# Altium schematic sheet Copy of tsop_mux.SchDoc
size A4
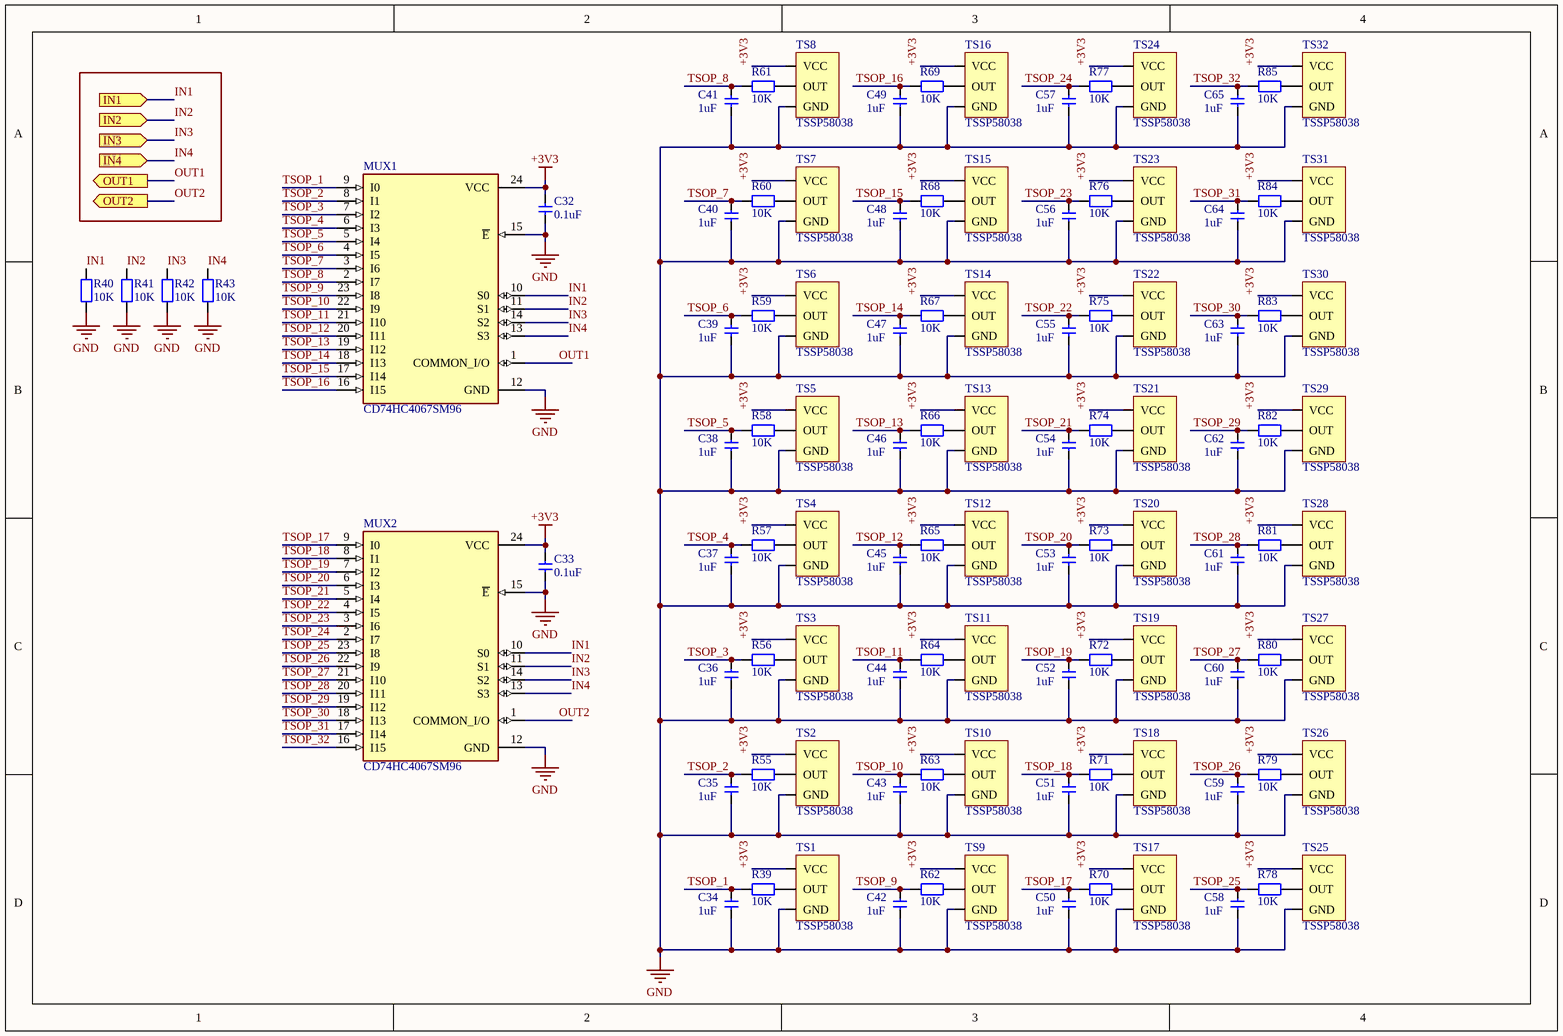
[diagram p0: Copy of tsop_mux.SchDoc]

## Parts
C32  0.1uF  [CAP0805]
C33  0.1uF  [CAP0805]
C34  1uF  [CAP1206]
C35  1uF  [CAP1206]
C36  1uF  [CAP1206]
C37  1uF  [CAP1206]
C38  1uF  [CAP1206]
C39  1uF  [CAP1206]
C40  1uF  [CAP1206]
C41  1uF  [CAP1206]
C42  1uF  [CAP1206]
C43  1uF  [CAP1206]
C44  1uF  [CAP1206]
C45  1uF  [CAP1206]
C46  1uF  [CAP1206]
C47  1uF  [CAP1206]
C48  1uF  [CAP1206]
C49  1uF  [CAP1206]
C50  1uF  [CAP1206]
C51  1uF  [CAP1206]
C52  1uF  [CAP1206]
C53  1uF  [CAP1206]
C54  1uF  [CAP1206]
C55  1uF  [CAP1206]
C56  1uF  [CAP1206]
C57  1uF  [CAP1206]
C58  1uF  [CAP1206]
C59  1uF  [CAP1206]
C60  1uF  [CAP1206]
C61  1uF  [CAP1206]
C62  1uF  [CAP1206]
C63  1uF  [CAP1206]
C64  1uF  [CAP1206]
C65  1uF  [CAP1206]
MUX1  CD74HC4067SM96  [CD74HC4067SM96]
MUX2  CD74HC4067SM96  [CD74HC4067SM96]
R39  10K  [RES0603]
R40  10K  [RES0805]
R41  10K  [RES0805]
R42  10K  [RES0805]
R43  10K  [RES0805]
R55  10K  [RES0603]
R56  10K  [RES0603]
R57  10K  [RES0603]
R58  10K  [RES0603]
R59  10K  [RES0603]
R60  10K  [RES0603]
R61  10K  [RES0603]
R62  10K  [RES0603]
R63  10K  [RES0603]
R64  10K  [RES0603]
R65  10K  [RES0603]
R66  10K  [RES0603]
R67  10K  [RES0603]
R68  10K  [RES0603]
R69  10K  [RES0603]
R70  10K  [RES0603]
R71  10K  [RES0603]
R72  10K  [RES0603]
R73  10K  [RES0603]
R74  10K  [RES0603]
R75  10K  [RES0603]
R76  10K  [RES0603]
R77  10K  [RES0603]
R78  10K  [RES0603]
R79  10K  [RES0603]
R80  10K  [RES0603]
R81  10K  [RES0603]
R82  10K  [RES0603]
R83  10K  [RES0603]
R84  10K  [RES0603]
R85  10K  [RES0603]
TS1  TSSP58038  [TSSP58038]
TS2  TSSP58038  [TSSP58038]
TS3  TSSP58038  [TSSP58038]
TS4  TSSP58038  [TSSP58038]
TS5  TSSP58038  [TSSP58038]
TS6  TSSP58038  [TSSP58038]
TS7  TSSP58038  [TSSP58038]
TS8  TSSP58038  [TSSP58038]
TS9  TSSP58038  [TSSP58038]
TS10  TSSP58038  [TSSP58038]
TS11  TSSP58038  [TSSP58038]
TS12  TSSP58038  [TSSP58038]
TS13  TSSP58038  [TSSP58038]
TS14  TSSP58038  [TSSP58038]
TS15  TSSP58038  [TSSP58038]
TS16  TSSP58038  [TSSP58038]
TS17  TSSP58038  [TSSP58038]
TS18  TSSP58038  [TSSP58038]
TS19  TSSP58038  [TSSP58038]
TS20  TSSP58038  [TSSP58038]
TS21  TSSP58038  [TSSP58038]
TS22  TSSP58038  [TSSP58038]
TS23  TSSP58038  [TSSP58038]
TS24  TSSP58038  [TSSP58038]
TS25  TSSP58038  [TSSP58038]
TS26  TSSP58038  [TSSP58038]
TS27  TSSP58038  [TSSP58038]
TS28  TSSP58038  [TSSP58038]
TS29  TSSP58038  [TSSP58038]
TS30  TSSP58038  [TSSP58038]
TS31  TSSP58038  [TSSP58038]
TS32  TSSP58038  [TSSP58038]

## Ports
IN1 (in), IN2 (in), IN3 (in), IN4 (in), OUT1 (out), OUT2 (out)

## Nets
+3V3: C32.2 C33.2 MUX1.24(VCC) MUX2.24(VCC) TS1.1(VCC) TS2.1(VCC) TS3.1(VCC) TS4.1(VCC) TS5.1(VCC) TS6.1(VCC) TS7.1(VCC) TS8.1(VCC) TS9.1(VCC) TS10.1(VCC) TS11.1(VCC) TS12.1(VCC) TS13.1(VCC) TS14.1(VCC) TS15.1(VCC) TS16.1(VCC) TS17.1(VCC) TS18.1(VCC) TS19.1(VCC) TS20.1(VCC) TS21.1(VCC) TS22.1(VCC) TS23.1(VCC) TS24.1(VCC) TS25.1(VCC) TS26.1(VCC) TS27.1(VCC) TS28.1(VCC) TS29.1(VCC) TS30.1(VCC) TS31.1(VCC) TS32.1(VCC)
GND: C32.1 C33.1 C34.2 C35.2 C36.2 C37.2 C38.2 C39.2 C40.2 C41.2 C42.2 C43.2 C44.2 C45.2 C46.2 C47.2 C48.2 C49.2 C50.2 C51.2 C52.2 C53.2 C54.2 C55.2 C56.2 C57.2 C58.2 C59.2 C60.2 C61.2 C62.2 C63.2 C64.2 C65.2 MUX1.12(GND) MUX1.15(~{E}) MUX2.12(GND) MUX2.15(~{E}) R40.1 R41.1 R42.1 R43.1 TS1.2(GND) TS2.2(GND) TS3.2(GND) TS4.2(GND) TS5.2(GND) TS6.2(GND) TS7.2(GND) TS8.2(GND) TS9.2(GND) TS10.2(GND) TS11.2(GND) TS12.2(GND) TS13.2(GND) TS14.2(GND) TS15.2(GND) TS16.2(GND) TS17.2(GND) TS18.2(GND) TS19.2(GND) TS20.2(GND) TS21.2(GND) TS22.2(GND) TS23.2(GND) TS24.2(GND) TS25.2(GND) TS26.2(GND) TS27.2(GND) TS28.2(GND) TS29.2(GND) TS30.2(GND) TS31.2(GND) TS32.2(GND)
IN1: MUX1.10(S0) MUX2.10(S0) R40.2 ; port IN1
IN2: MUX1.11(S1) MUX2.11(S1) R41.2 ; port IN2
IN3: MUX1.14(S2) MUX2.14(S2) R42.2 ; port IN3
IN4: MUX1.13(S3) MUX2.13(S3) R43.2 ; port IN4
OUT1: MUX1.1(COMMON_I/O) ; port OUT1
OUT2: MUX2.1(COMMON_I/O) ; port OUT2
TSOP_1: C34.1 MUX1.9(I0) R39.1
TSOP_2: C35.1 MUX1.8(I1) R55.1
TSOP_3: C36.1 MUX1.7(I2) R56.1
TSOP_4: C37.1 MUX1.6(I3) R57.1
TSOP_5: C38.1 MUX1.5(I4) R58.1
TSOP_6: C39.1 MUX1.4(I5) R59.1
TSOP_7: C40.1 MUX1.3(I6) R60.1
TSOP_8: C41.1 MUX1.2(I7) R61.1
TSOP_9: C42.1 MUX1.23(I8) R62.1
TSOP_10: C43.1 MUX1.22(I9) R63.1
TSOP_11: C44.1 MUX1.21(I10) R64.1
TSOP_12: C45.1 MUX1.20(I11) R65.1
TSOP_13: C46.1 MUX1.19(I12) R66.1
TSOP_14: C47.1 MUX1.18(I13) R67.1
TSOP_15: C48.1 MUX1.17(I14) R68.1
TSOP_16: C49.1 MUX1.16(I15) R69.1
TSOP_17: C50.1 MUX2.9(I0) R70.1
TSOP_18: C51.1 MUX2.8(I1) R71.1
TSOP_19: C52.1 MUX2.7(I2) R72.1
TSOP_20: C53.1 MUX2.6(I3) R73.1
TSOP_21: C54.1 MUX2.5(I4) R74.1
TSOP_22: C55.1 MUX2.4(I5) R75.1
TSOP_23: C56.1 MUX2.3(I6) R76.1
TSOP_24: C57.1 MUX2.2(I7) R77.1
TSOP_25: C58.1 MUX2.23(I8) R78.1
TSOP_26: C59.1 MUX2.22(I9) R79.1
TSOP_27: C60.1 MUX2.21(I10) R80.1
TSOP_28: C61.1 MUX2.20(I11) R81.1
TSOP_29: C62.1 MUX2.19(I12) R82.1
TSOP_30: C63.1 MUX2.18(I13) R83.1
TSOP_31: C64.1 MUX2.17(I14) R84.1
TSOP_32: C65.1 MUX2.16(I15) R85.1
NetR39_2: R39.2 TS1.3(OUT)
NetR55_2: R55.2 TS2.3(OUT)
NetR56_2: R56.2 TS3.3(OUT)
NetR57_2: R57.2 TS4.3(OUT)
NetR58_2: R58.2 TS5.3(OUT)
NetR59_2: R59.2 TS6.3(OUT)
NetR60_2: R60.2 TS7.3(OUT)
NetR61_2: R61.2 TS8.3(OUT)
NetR62_2: R62.2 TS9.3(OUT)
NetR63_2: R63.2 TS10.3(OUT)
NetR64_2: R64.2 TS11.3(OUT)
NetR65_2: R65.2 TS12.3(OUT)
NetR66_2: R66.2 TS13.3(OUT)
NetR67_2: R67.2 TS14.3(OUT)
NetR68_2: R68.2 TS15.3(OUT)
NetR69_2: R69.2 TS16.3(OUT)
NetR70_2: R70.2 TS17.3(OUT)
NetR71_2: R71.2 TS18.3(OUT)
NetR72_2: R72.2 TS19.3(OUT)
NetR73_2: R73.2 TS20.3(OUT)
NetR74_2: R74.2 TS21.3(OUT)
NetR75_2: R75.2 TS22.3(OUT)
NetR76_2: R76.2 TS23.3(OUT)
NetR77_2: R77.2 TS24.3(OUT)
NetR78_2: R78.2 TS25.3(OUT)
NetR79_2: R79.2 TS26.3(OUT)
NetR80_2: R80.2 TS27.3(OUT)
NetR81_2: R81.2 TS28.3(OUT)
NetR82_2: R82.2 TS29.3(OUT)
NetR83_2: R83.2 TS30.3(OUT)
NetR84_2: R84.2 TS31.3(OUT)
NetR85_2: R85.2 TS32.3(OUT)

## Library data of the parts
C32-C65 = CAP Ceramic: Ceramic SMD Cap
MUX1 MUX2 = CD74HC4067SM96: SSOP-24
R39-R43 R55-R85 = RES: RES smd